# Altium schematic sheet MainController.SchDoc: Main Controller
size B; Date: 7/13/2012; ApprovedBy: Levi Balling; CheckedBy: Dell Hanks; Author: Levi Balling; CompanyName: Smart Home; DrawnBy: Levi Balling; Engineer: Levi Balling; Organization: Smart Home; Address1: Univerisity of Utah; DocumentNumber: 1; Revision: 2; SheetNumber: 1; SheetTotal: 1; CurrentDate: 7/13/2012; DocumentName: Main Controller; ProjectName: Smart Home
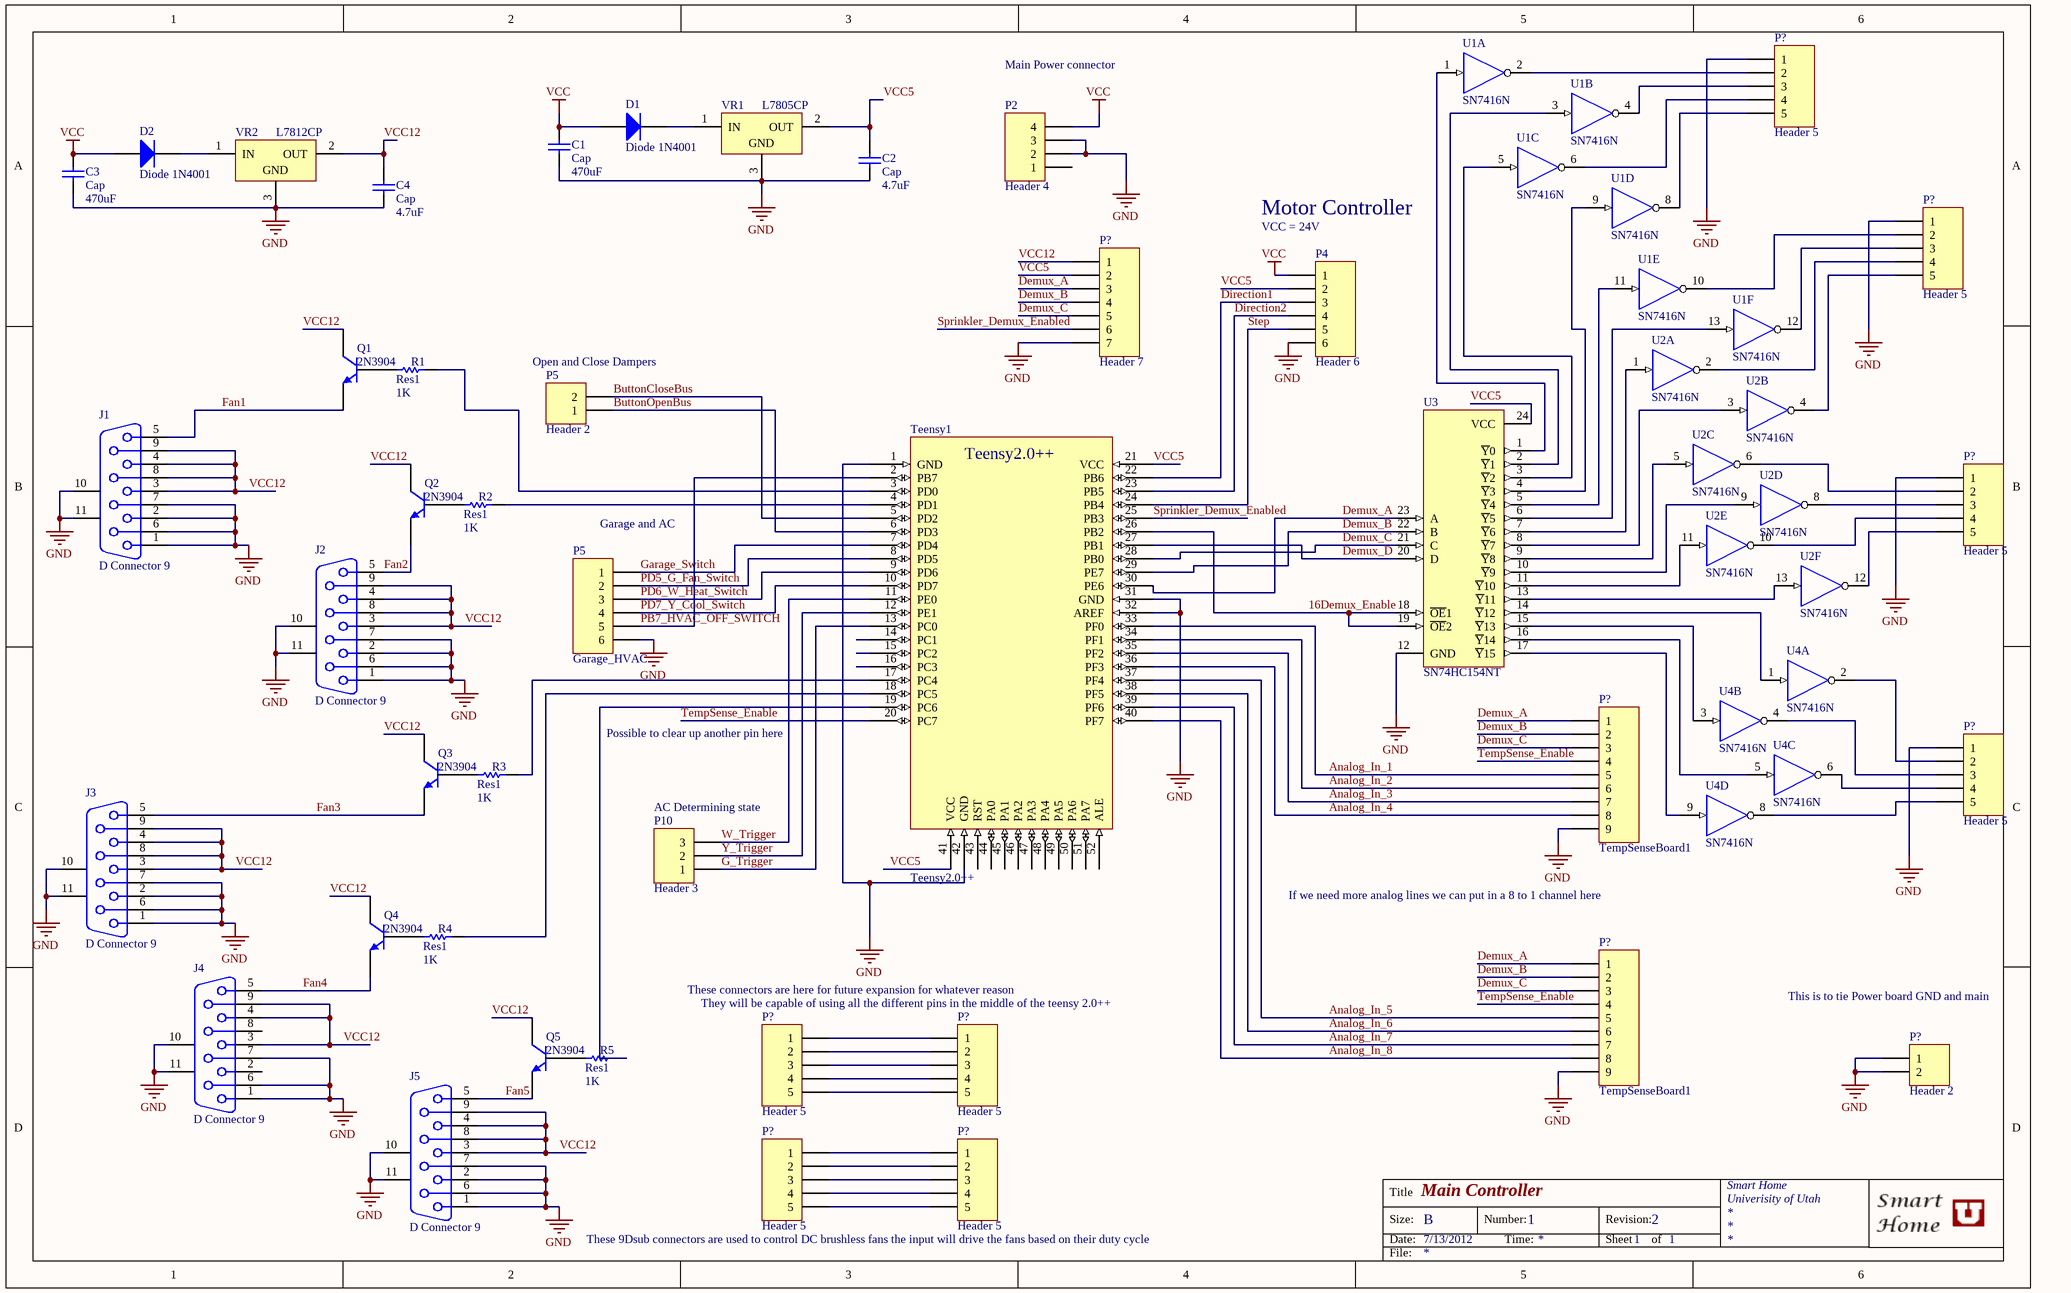
[diagram p0: MainController.SchDoc]

## Parts
(Parts that share a designator on the sheet are numbered #1, #2 ... from top to bottom, then left to right.)
C1  Cap  value 470uF  [RAD-0.3]
C2  Cap  value 4.7uF  [RAD-0.3]
C3  Cap  value 470uF  [RAD-0.3]
C4  Cap  value 4.7uF  [RAD-0.3]
D1  Diode 1N4001  [DO-41]
D2  Diode 1N4001  [DO-41]
J1  D Connector 9  [DSUB1.385-2H9]
J2  D Connector 9  [DSUB1.385-2H9]
J3  D Connector 9  [DSUB1.385-2H9]
J4  D Connector 9  [DSUB1.385-2H9]
J5  D Connector 9  [DSUB1.385-2H9]
P2  Header 4  [MainPowerConnector]
P4  Header 6  [HDR1X6]
P5#1  Header 2  [HDR1X2]
P5#2  Garage_HVAC  [HDR1X6]
P10  Header 3  [HDR1X3]
P?#1  Header 5  [HDR1X5]
P?#2  Header 5  [HDR1X5]
P?#3  Header 7  [HDR1X7]
P?#4  Header 5  [HDR1X5]
P?#5  TempSenseBoard1  [HDR1X9]
P?#6  Header 5  [HDR1X5]
P?#7  TempSenseBoard1  [HDR1X9]
P?#8  Header 5  [HDR1X5]
P?#9  Header 5  [HDR1X5]
P?#10  Header 2  [HDR1X2]
P?#11  Header 5  [HDR1X5]
P?#12  Header 5  [HDR1X5]
Q1  2N3904  [2N3904]
Q2  2N3904  [2N3904]
Q3  2N3904  [2N3904]
Q4  2N3904  [2N3904]
Q5  2N3904  [2N3904]
R1  Res1  value 1K  [AXIAL-0.3]
R2  Res1  value 1K  [AXIAL-0.3]
R3  Res1  value 1K  [AXIAL-0.3]
R4  Res1  value 1K  [AXIAL-0.3]
R5  Res1  value 1K  [AXIAL-0.3]
Teensy1  Teensy2.0++  [Teensy2.0++]
U1  SN7416N  [N014]  (parts A,B,C,D,E,F of 6)
U2  SN7416N  [N014]  (parts A,B,C,D,E,F of 6)
U3  SN74HC154NT  [NT024D]
U4  SN7416N  [N014]  (parts A,B,C,D of 6)
VR1  L7805CP  [ISOWATT220AB]
VR2  L7812CP  [ISOWATT220AB]

## Nets
GND: C1.2 C2.2 C3.2 C4.2 J1.1 J1.2 J1.6 J1.7 J1.10(MH1) J1.11(MH2) J2.1 J2.2 J2.6 J2.7 J2.10(MH1) J2.11(MH2) J3.1 J3.2 J3.6 J3.7 J3.10(MH1) J3.11(MH2) J4.1 J4.6 J4.7 J4.10(MH1) J4.11(MH2) J5.1 J5.2 J5.6 J5.7 J5.10(MH1) J5.11(MH2) P2.2 P2.3 P4.6 P5#2.6 P?#1.1 P?#2.1 P?#3.7 P?#4.1 P?#5.9 P?#6.1 P?#7.9 P?#10.1 P?#10.2 Teensy1.1(GND) Teensy1.31(GND) Teensy1.32(AREF) Teensy1.42(GND) U1.7(GND) U2.7(GND) U3.12(GND) U4.7(GND) VR1.3(GND) VR2.3(GND)
VCC: C1.1 C3.1 D1.1(A) D2.1(A) P2.4 P4.1 U1.14(VCC) U2.14(VCC) U4.14(VCC5)
16Demux_Enable: Teensy1.26(PB2) U3.18(~{OE}1) U3.19(~{OE}2)
Analog_In_1: P?#5.5 Teensy1.33(PF0)
Analog_In_2: P?#5.6 Teensy1.34(PF1)
Analog_In_3: P?#5.7 Teensy1.35(PF2)
Analog_In_4: P?#5.8 Teensy1.36(PF3)
Analog_In_5: P?#7.5 Teensy1.37(PF4)
Analog_In_6: P?#7.6 Teensy1.38(PF5)
Analog_In_7: P?#7.7 Teensy1.39(PF6)
Analog_In_8: P?#7.8 Teensy1.40(PF7)
ButtonCloseBus: P5#1.2 Teensy1.5(PD2)
ButtonOpenBus: P5#1.1 Teensy1.6(PD3)
Demux_A: P?#3.3 P?#5.1 P?#7.1 Teensy1.30(PE6) U3.23(A)
Demux_B: P?#3.4 P?#5.2 P?#7.2 Teensy1.29(PE7) U3.22(B)
Demux_C: P?#3.5 P?#5.3 P?#7.3 Teensy1.28(PB0) U3.21(C)
Demux_D: Teensy1.27(PB1) U3.20(D)
Direction1: P4.3 Teensy1.22(PB6)
Direction2: P4.4 Teensy1.23(PB5)
Fan1: J1.5 Q1.1(E)
Fan2: J2.5 Q2.1(E)
Fan3: J3.5 Q3.1(E)
Fan4: J4.5 Q4.1(E)
Fan5: J5.5 Q5.1(E)
G_Trigger: P10.1 Teensy1.13(PC0)
Garage_Switch: P5#2.1 Teensy1.7(PD4)
PB7_HVAC_OFF_SWITCH: P5#2.5 Teensy1.2(PB7)
PD5_G_Fan_Switch: P5#2.2 Teensy1.8(PD5)
PD6_W_Heat_Switch: P5#2.3 Teensy1.9(PD6)
PD7_Y_Cool_Switch: P5#2.4 Teensy1.10(PD7)
Sprinkler_Demux_Enabled: P?#3.6 Teensy1.25(PB3)
Step: P4.5 Teensy1.24(PB4)
TempSense_Enable: P?#5.4 P?#7.4 Teensy1.20(PC7)
VCC5: C2.1 P4.2 P?#3.2 Teensy1.21(VCC) Teensy1.41(VCC) U3.24(VCC) VR1.2(OUT)
VCC12: C4.1 J1.3 J1.4 J1.8 J1.9 J2.3 J2.4 J2.8 J2.9 J3.3 J3.4 J3.8 J3.9 J4.3 J4.4 J4.9 J5.3 J5.4 J5.8 J5.9 P?#3.1 Q1.3(C) Q2.3(C) Q3.3(C) Q4.3(C) Q5.3(C) VR2.2(OUT)
W_Trigger: P10.3 Teensy1.11(PE0)
Y_Trigger: P10.2 Teensy1.12(PE1)
NetD1_2: D1.2(K) VR1.1(IN)
NetD2_2: D2.2(K) VR2.1(IN)
NetP?#1_2: P?#1.2 U1.2(Y)
NetP?#1_3: P?#1.3 U1.4(Y)
NetP?#1_4: P?#1.4 U1.6(Y)
NetP?#1_5: P?#1.5 U1.8(Y)
NetP?#2_2: P?#2.2 U1.10(Y)
NetP?#2_3: P?#2.3 U1.12(Y)
NetP?#2_4: P?#2.4 U2.2(Y)
NetP?#2_5: P?#2.5 U2.4(Y)
NetP?#4_2: P?#4.2 U2.6(Y)
NetP?#4_3: P?#4.3 U2.8(Y)
NetP?#4_4: P?#4.4 U2.10(Y)
NetP?#4_5: P?#4.5 U2.12(Y)
NetP?#6_2: P?#6.2 U4.2(Y)
NetP?#6_3: P?#6.3 U4.4(Y)
NetP?#6_4: P?#6.4 U4.6(Y)
NetP?#6_5: P?#6.5 U4.8(Y)
NetP?#8_1: P?#8.1 P?#9.1
NetP?#8_2: P?#8.2 P?#9.2
NetP?#8_3: P?#8.3 P?#9.3
NetP?#8_4: P?#8.4 P?#9.4
NetP?#8_5: P?#8.5 P?#9.5
NetP?#11_1: P?#11.1 P?#12.1
NetP?#11_2: P?#11.2 P?#12.2
NetP?#11_3: P?#11.3 P?#12.3
NetP?#11_4: P?#11.4 P?#12.4
NetP?#11_5: P?#11.5 P?#12.5
NetQ1_2: Q1.2(B) R1.1
NetQ2_2: Q2.2(B) R2.1
NetQ3_2: Q3.2(B) R3.1
NetQ4_2: Q4.2(B) R4.1
NetQ5_2: Q5.2(B) R5.1
NetR1_2: R1.2 Teensy1.3(PD0)
NetR2_2: R2.2 Teensy1.4(PD1)
NetR3_2: R3.2 Teensy1.17(PC4)
NetR4_2: R4.2 Teensy1.18(PC5)
NetR5_2: R5.2 Teensy1.19(PC6)
NetU1_1: U1.1(A) U3.1(~{Y}0)
NetU1_3: U1.3(A) U3.2(~{Y}1)
NetU1_5: U1.5(A) U3.3(~{Y}2)
NetU1_9: U1.9(A) U3.4(~{Y}3)
NetU1_11: U1.11(A) U3.5(~{Y}4)
NetU1_13: U1.13(A) U3.6(~{Y}5)
NetU2_1: U2.1(A) U3.7(~{Y}6)
NetU2_3: U2.3(A) U3.8(~{Y}7)
NetU2_5: U2.5(A) U3.9(~{Y}8)
NetU2_9: U2.9(A) U3.10(~{Y}9)
NetU2_11: U2.11(A) U3.11(~{Y}10)
NetU2_13: U2.13(A) U3.13(~{Y}11)
NetU3_14: U3.14(~{Y}12) U4.1(A)
NetU3_15: U3.15(~{Y}13) U4.3(A)
NetU3_16: U3.16(~{Y}14) U4.5(A)
NetU3_17: U3.17(~{Y}15) U4.9(A)

Not connected (* = marked no-connect by the designer): J4 2 8; P2 1; Teensy1 14(PC1) 15(PC2) 16(PC3) 43(RST) 44(PA0) 45(PA1) 46(PA2) 47(PA3) 48(PA4) 49(PA5) 50(PA6) 51(PA7) 52(ALE)

## Notes on the sheet
- Main Power connector
- Motor Controller
- (near P4) VCC = 24V
- (near P5#1) Open and Close Dampers
- (near P5#2) Garage and AC
- Possible to clear up another pin here
- (near P10) AC Determining state
- If we need more analog lines we can put in a 8 to 1 channel here
- (near P?#9) These connectors are here for future expansion for whatever reason
- (near P?#9) They will be capable of using all the different pins in the middle of the teensy 2.0++
- This is to tie Power board GND and main
- (near P?#12) These 9Dsub connectors are used to control DC brushless fans the input will drive the fans based on their duty cycle
- Title
- Size:
- Date:
- B
- Number:
- Time:
- Revision:
- Sheet
- of
- File:

## Library data of the parts
C1-C4 = Cap: Capacitor; Published: 8-Jun-2000; LatestRevisionDate: 17-Jul-2002; LatestRevisionNote: Re-released for DXP Platform.; PackageReference: RAD-0.3; Publisher: Altium Limited; PackageDescription: Radial Cap, Thru-Hole; 2 Leads; 0.3 in Pin Spacing
D1 D2 = Diode 1N4001: 1 Amp General Purpose Rectifier; Published: 8-Jun-2000; LatestRevisionDate: 17-Jul-2002; LatestRevisionNote: Re-released for DXP Platform.; DatasheetVersion: 1998; PackageVersion: Aug-1999; PackageReference: DO-41; Publisher: Altium Limited; PackageDescription: Diode, Axial; Body 5.2 x 2.7 mm (LxDia. max), Lead Dia. 0.86 mm (max); Code_JEDEC: DO-204-AL; ComponentLink1Description: Manufacturer Link; ComponentLink1URL: http://www.fairchildsemi.com/; ComponentLink2Description: Datasheet; ComponentLink2URL: http://www.fairchildsemi.com/ds/1N%2F1N4001.pdf
J1-J5 = D Connector 9: Receptacle Assembly, 9 Position, Right Angle; PackageDocument: O; Positions: 9; Published: 15-Jun-2001; LatestRevisionDate: 17-Jul-2002; LatestRevisionNote: Re-released for DXP Platform.; DatasheetDocument: 1-Sep-1999; PackageReference: 788750; Publisher: Altium Limited; Orientation: Right Angle; Gender: Receptacle
P2 = Header 4: Header, 4-Pin; LatestRevisionDate: 17-Jul-2002; LatestRevisionNote: Re-released for DXP Platform.; Publisher: Altium Limited
P4 P5#2 = Header 6: Header, 6-Pin; LatestRevisionDate: 17-Jul-2002; LatestRevisionNote: Re-released for DXP Platform.; Publisher: Altium Limited
P5#1 P?#10 = Header 2: Header, 2-Pin; LatestRevisionDate: 17-Jul-2002; LatestRevisionNote: Re-released for DXP Platform.; Publisher: Altium Limited
P10 = Header 3: Header, 3-Pin; LatestRevisionDate: 17-Jul-2002; LatestRevisionNote: Re-released for DXP Platform.; Publisher: Altium Limited
P?#1 P?#2 P?#4 P?#6 P?#8 P?#9 P?#11 P?#12 = Header 5: Header, 5-Pin; LatestRevisionDate: 17-Jul-2002; LatestRevisionNote: Re-released for DXP Platform.; Publisher: Altium Limited
P?#3 = Header 7: Header, 7-Pin; LatestRevisionDate: 17-Jul-2002; LatestRevisionNote: Re-released for DXP Platform.; Publisher: Altium Limited
P?#5 P?#7 = Header 9: Header, 9-Pin; LatestRevisionDate: 17-Jul-2002; LatestRevisionNote: Re-released for DXP Platform.; Publisher: Altium Limited
Q1-Q5 = 2N3904: NPN General Purpose Amplifier; Published: 8-Jun-2000; LatestRevisionDate: 15-Jan-2003; LatestRevisionNote: PCB Footprint 'BCY-W3/D4.7' replaced; DatasheetVersion: 1997; PackageVersion: Sep-1998; PackageReference: TO-92A; Publisher: Altium Limited; PackageDescription: TO, Flat Index; 3 In-Line, Axial Leads; Body Dia. 4.5mm; Leads 0.51 x 0.48 mm (max); ComponentLink1Description: Manufacturer Link; ComponentLink1URL: http://www.fairchildsemi.com/; ComponentLink2Description: Datasheet; ComponentLink2URL: http://www.fairchildsemi.com/ds/2N%2F2N3904.pdf
R1-R5 = Res1: Resistor; Published: 8-Jun-2000; LatestRevisionDate: 17-Jul-2002; LatestRevisionNote: Re-released for DXP Platform.; PackageReference: AXIAL-0.3; Publisher: Altium Limited; PackageDescription: Axial Device, Thru-Hole; 2 Leads; 0.3 in Pin Spacing
Teensy1 = Teensy2.0++: The teensy 2.0 from www.PJRC.com
U1 U2 U4 = SN7416N: Hex Inverter Buffer / Driver with High-Voltage Outputs; Published: 8-Jun-2000; LatestRevisionDate: 04-Mar-2005; LatestRevisionNote: Stylized 3D Model Added.; DatasheetVersion: Mar-1988; PackageVersion: Oct-1995; PackageReference: N014; Publisher: Altium Limited; PackageDescription: DIP; 14 Leads; Row Spacing 7.62 mm; Pitch 2.54 mm; ComponentLink1Description: Manufacturer Link; ComponentLink1URL: http://www.ti.com/; ComponentLink2Description: Datasheet; ComponentLink2URL: http://www-s.ti.com/sc/ds/sn5416.pdf; ComponentLink3Description: Packaging Specification; ComponentLink3URL: http://focus.ti.com/lit/ml/mpdi002c/mpdi002c.pdf
U3 = SN74HC154NT: 4-Line to 16-Line Decoder / Demultiplexer; ComponentAvailability: Obsolete; Published: 8-Jun-2000; LatestRevisionDate: 04-Mar-2005; LatestRevisionNote: Stylized 3D Model Added.; DatasheetVersion: Sep-1987; PackageVersion: Oct-1994; PackageReference: NT024D; Publisher: Altium Limited; PackageDescription: DIP; 24 Leads; Row Spacing 7.62 mm; Pitch 2.54 mm; Code_JEDEC: MS-001-AF; ComponentLink1Description: Manufacturer Link; ComponentLink1URL: http://www.ti.com/; ComponentLink2Description: Discontinuation Notice; ComponentLink2URL: http://focus.ti.com/docs/prod/folders/print/sn74hc154.html
VR1 VR2 = L7805CP: Positive Voltage Regulator; Note: Tab is connected to pin 3 (GND).; Published: 24-Aug-2001; LatestRevisionDate: 17-Jul-2002; LatestRevisionNote: Re-released for DXP Platform.; DatasheetVersion: Dec-1998; PackageVersion: Jul-1998; PackageReference: ISOWATT220AB; Publisher: Altium Limited; PackageDescription: TO, Thru-Hole, Vertical, Heatsink Mounted; 3 In-Line Leads; Pitch 2.54 mm; Pin sequence 1, 3, 2; ComponentLink1Description: Manufacturer Link; ComponentLink1URL: http://www.st.com/